# Altium schematic sheet MAZ000154 - Diagrama físico.SchDoc: MAZ000154 - Diagrama físico
size A; ApprovedBy: Christian Ledwidth; CheckedBy: Nahuel Martinez; Author: Santiago Marti; CompanyName: Body Health; DrawnBy: Santiago Marti; Revision: A; SheetNumber: 2; SheetTotal: 2
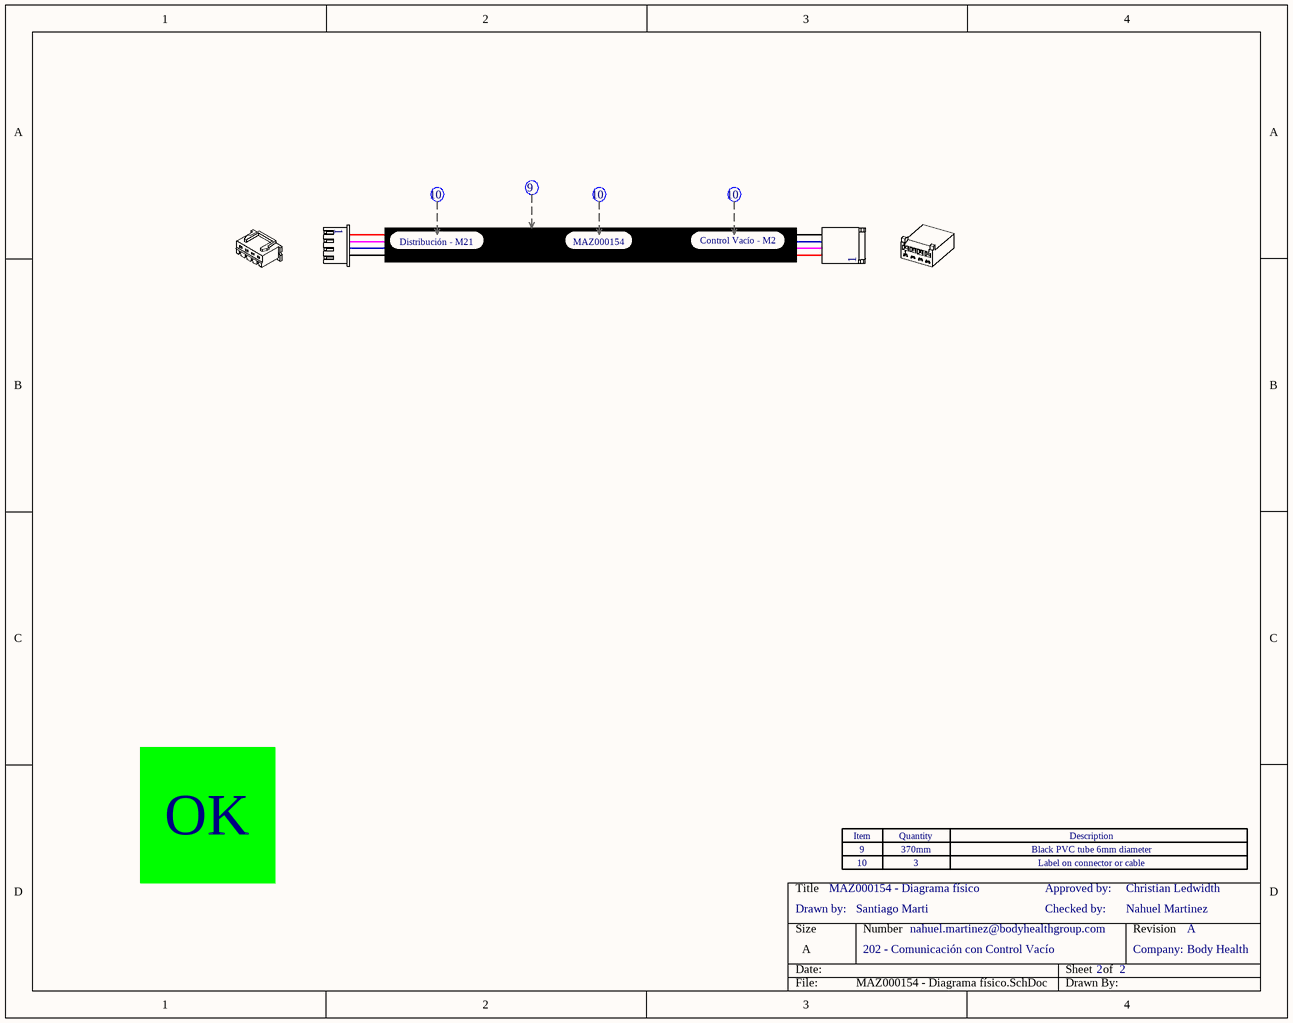
[diagram p0: MAZ000154 - Diagrama físico.SchDoc]

## Parts
(Parts that share a designator on the sheet are numbered #1, #2 ... from top to bottom, then left to right.)
Con?#1  XHP-4  (value not drawn)  (part A of 4)
Con?#2  CST-100-4  (value not drawn)  (part A of 4)
Con?#3  CST-100-4  (value not drawn)  (part B of 4)
Con?#4  XHP-4  (value not drawn)  (part B of 4)
Eti?#1  Etiqueta  (value not drawn)
Eti?#2  Etiqueta  (value not drawn)
Eti?#3  Etiqueta  (value not drawn)
Ter?  Termocontraible  (value not drawn)
Zoc1  Zócalo_Header  (value not drawn)
Zoc10  Zócalo_Item  (value not drawn)
Zoc11  Zócalo_Item  (value not drawn)

## Notes on the sheet
- Distribución - M21
- MAZ000154
- Control Vacío - M2
- OK
- Drawn by:
- 10
- 9
- 3
- 370mm
- Checked by:
- Approved by:
- Label on connector or cable
- Black PVC tube 6mm diameter
- 202 - Comunicación con Control Vacío
- nahuel.martinez@bodyhealthgroup.com
- Company:
- (in symbol Zócalo_Header) Item; Quantity; Description

## Library data of the parts
Con?#1 Con?#4 = XHP-4: CONN HOUSING 2.5MM 4POS; Fabricante: JST Sales America Inc.; Cod.DigiKey: 455-2267-ND; Cod.Fabricante: XHP-4; ComponentLink1Description: Manufacturer Link; ComponentLink1URL: http://www.jst-mfg.com/product/pdf/eng/eXH.pdf; DIGIKEYx50: 0.06220; CallOut: *; DIGIKEYx100: NO
Con?#2 Con?#3 = CST-100-4: CONN RCPT HSNG 4POS CST-100 II; Cod.Fabricante: 1375820-4; Fabricante: TE Connectivity AMP Connectors; Cod.DigiKey: A99615-ND; ComponentLink1Description: Manufacturer Link; ComponentLink1URL: https://www.te.com/commerce/DocumentDelivery/DDEController?Action=srchrtrv&DocNm=1375820&DocType=Customer+Drawing&DocLang=English; DIGIKEYx50: 0.18440; CallOut: *; DIGIKEYx100: 0.17120
Eti?#1-Eti?#3 = Etiqueta: CallOut: 10; Texto: *
Ter? = Termocontraible: CallOut: 9; Largo: *; Diámetro: *
Zoc1 = Zócalo_Header: Header para el zócalo de referencias
Zoc10 Zoc11 = Zócalo_Item: Ítem para el zócalo de referencias; Desginator: *; Quantity: *; ItemDescription: *